# Altium schematic sheet MicroC.SchDoc
size A3; SheetNumber: 2; SheetTotal: 2; SPICEModelCacheYAVJPGAA: <root> / <DocumentId>YAVJPGAA</DocumentId> / <CacheFrame Number="0"> / <Model Name="cap" Kind="MDL"> / <Text>*Default semiconductor capacitor / .MODEL CAP C()</Text> / </Model> / </CacheFrame> / </root>
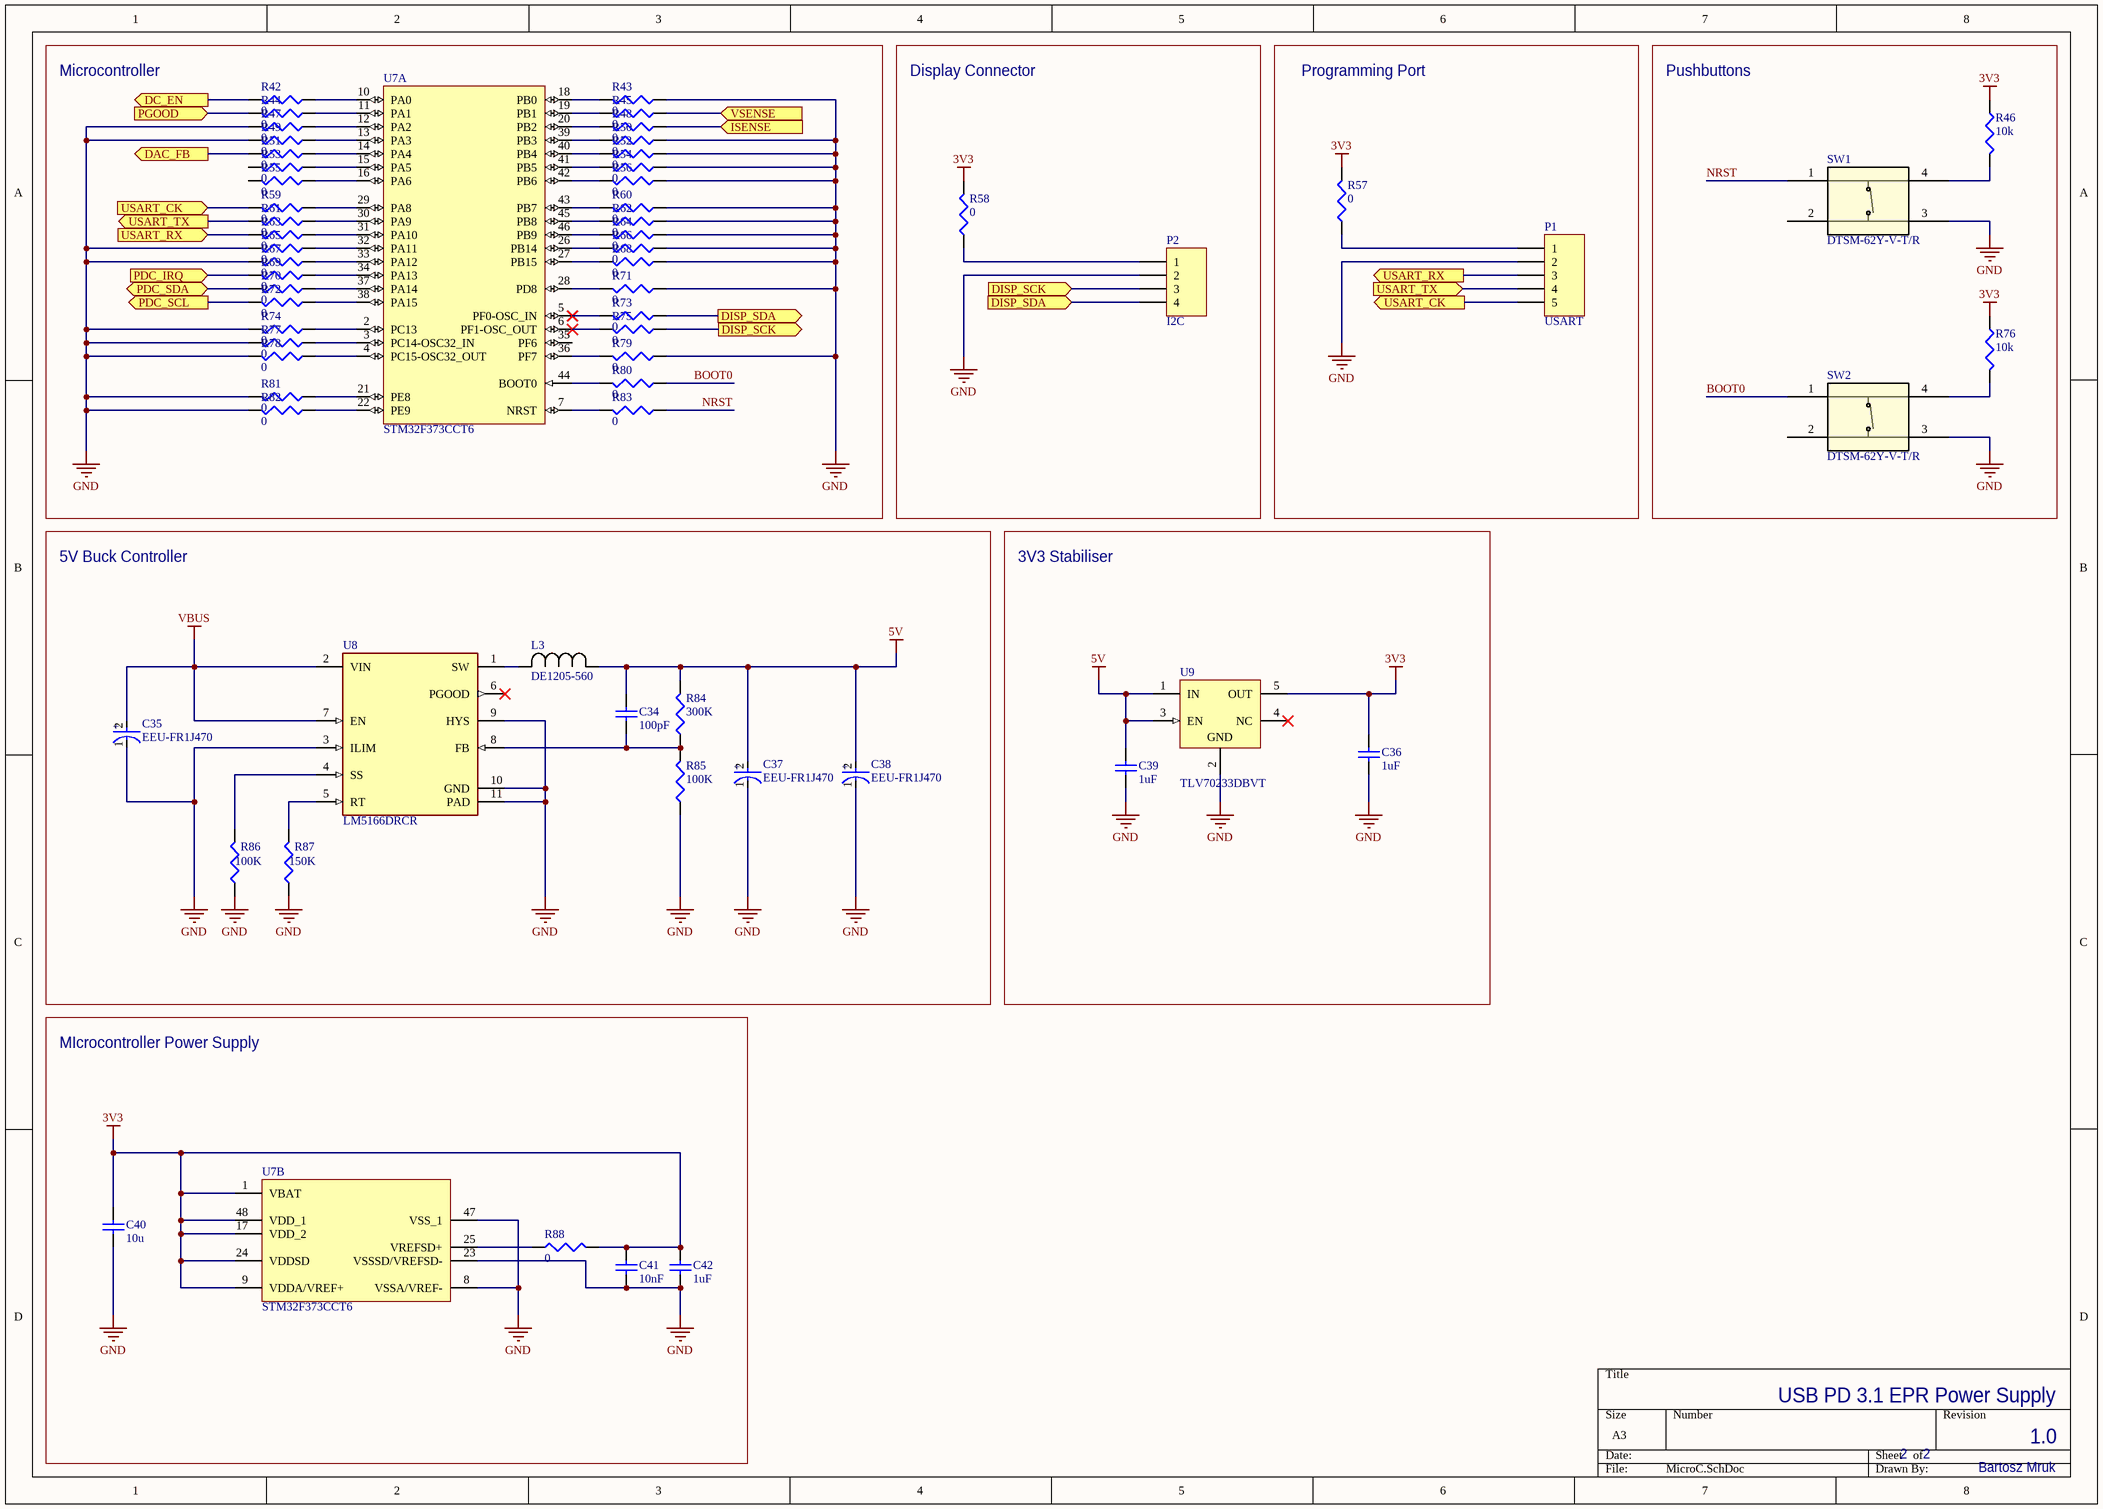
[diagram p0: MicroC.SchDoc]

## Parts
C34  value 100pF  [C1206]  (hidden comment: Cap Semi)
C35  EEU-FR1J470  [FP-EEU-FR1J470-MFG]
C36  value 1uF  [C1206]  (hidden comment: Cap Semi)
C37  EEU-FR1J470  [FP-EEU-FR1J470-MFG]
C38  EEU-FR1J470  [FP-EEU-FR1J470-MFG]
C39  value 1uF  [C1206]  (hidden comment: Cap Semi)
C40  value 10u  [C1206]  (hidden comment: Cap Semi)
C41  value 10nF  [C1206]  (hidden comment: Cap Semi)
C42  value 1uF  [C1206]  (hidden comment: Cap Semi)
L3  DE1205-560  [IND_DE1205_FRC]
P1  USART  [HDR1X5]
P2  I2C  [HDR1X4]
R42  value 0  [J1-0603]
R43  value 0  [J1-0603]
R44  value 0  [J1-0603]
R45  value 0  [J1-0603]
R46  value 10k  [J1-0603]
R47  value 0  [J1-0603]
R48  value 0  [J1-0603]
R49  value 0  [J1-0603]
R50  value 0  [J1-0603]
R51  value 0  [J1-0603]
R52  value 0  [J1-0603]
R53  value 0  [J1-0603]
R54  value 0  [J1-0603]
R55  value 0  [J1-0603]
R56  value 0  [J1-0603]
R57  value 0  [J1-0603]  (hidden comment: Res3)
R58  value 0  [J1-0603]  (hidden comment: Res3)
R59  value 0  [J1-0603]
R60  value 0  [J1-0603]
R61  value 0  [J1-0603]
R62  value 0  [J1-0603]
R63  value 0  [J1-0603]
R64  value 0  [J1-0603]
R65  value 0  [J1-0603]
R66  value 0  [J1-0603]
R67  value 0  [J1-0603]
R68  value 0  [J1-0603]
R69  value 0  [J1-0603]
R70  value 0  [J1-0603]
R71  value 0  [J1-0603]
R72  value 0  [J1-0603]
R73  value 0  [J1-0603]
R74  value 0  [J1-0603]
R75  value 0  [J1-0603]
R76  value 10k  [J1-0603]
R77  value 0  [J1-0603]
R78  value 0  [J1-0603]
R79  value 0  [J1-0603]
R80  value 0  [J1-0603]
R81  value 0  [J1-0603]
R82  value 0  [J1-0603]
R83  value 0  [J1-0603]
R84  value 300K  [J1-0603]  (hidden comment: Res3)
R85  value 100K  [J1-0603]  (hidden comment: Res3)
R86  value 100K  [J1-0603]  (hidden comment: Res3)
R87  value 150K  [J1-0603]  (hidden comment: Res3)
R88  value 0  [J1-0603]  (hidden comment: Res3)
SW1  DTSM-62Y-V-T/R  [DTSM-62_DIP]
SW2  DTSM-62Y-V-T/R  [DTSM-62_DIP]
U7  STM32F373CCT6  [STM-LQFP48_M]  (parts A,B of 2)
U8  LM5166DRCR  [FP-DRC0010J-MFG]
U9  TLV70233DBVT  [DBV0005A_M]

## Blocks framed on the sheet
Microcontroller: R42-R45 R47-R56 R59-R75 R77-R83 U7
Display Connector: P2 R58
Programming Port: P1 R57
Pushbuttons: R46 R76 SW1 SW2
5V Buck Controller: C34 C35 C37 C38 L3 R84-R87 U8
3V3 Stabiliser: C36 C39 U9
MIcrocontroller Power Supply: C40-C42 R88 U7

## Ports
DAC_FB (out, see Main[4D]), DC_EN (out, see Main[2D]), DISP_SCK (in, see MicroC[3A]), DISP_SCK (out, see MicroC[4A]), DISP_SDA (in, see MicroC[3A]), DISP_SDA (out, see MicroC[4A]), ISENSE (in, see Main[5B]), PDC_IRQ (in, see Main[6A]), PDC_SCL (out, see Main[6A]), PDC_SDA (bidir, see Main[6A]), PGOOD (in, see Main[2D]), USART_CK (in, see MicroC[6A]), USART_CK (out, see MicroC[1A]), USART_RX (in, see MicroC[6A]), USART_RX (out, see MicroC[1A]), USART_TX (in, see MicroC[1A]), USART_TX (out, see MicroC[6A]), VSENSE (in, see Main[3B])

## Nets
3V3: C36.2 C40.2 C41.2 C42.2 R46.1 R57.2 R58.2 R76.1 R88.2 U7.1(VBAT) U7.9(VDDA/VREF+) U7.17(VDD_2) U7.24(VDDSD) U7.48(VDD_1) U9.5(OUT)
5V: C34.2 C37.2(A) C38.2(A) C39.2 L3.1 R84.2 U9.1(IN) U9.3(EN)
GND: C35.1(C) C36.1 C37.1(C) C38.1(C) C39.1 C40.1 C41.1 C42.1 P1.2 P2.2 R43.1 R47.2 R49.2 R50.1 R52.1 R54.1 R56.1 R60.1 R62.1 R64.1 R65.2 R66.1 R67.2 R68.1 R71.1 R74.2 R77.2 R78.2 R79.1 R81.2 R82.2 R85.1 R86.1 R87.1 SW1.3 SW2.3 U7.8(VSSA/VREF-) U7.23(VSSSD/VREFSD-) U7.47(VSS_1) U8.3(ILIM) U8.9(HYS) U8.10(GND) U8.11(PAD) U9.2(GND)
VBUS: C35.2(A) U8.2(VIN) U8.7(EN)
BOOT0: R80.1 SW2.1
DAC_FB: R51.2 ; port DAC_FB
DC_EN: R42.2 ; port DC_EN
DISP_SCK: P2.3 R75.1 ; port DISP_SCK
DISP_SDA: P2.4 R73.1 ; port DISP_SDA
ISENSE: R48.1 ; port ISENSE
NRST: R83.1 SW1.1
PDC_IRQ: R69.2 ; port PDC_IRQ
PDC_SCL: R72.2 ; port PDC_SCL
PDC_SDA: R70.2 ; port PDC_SDA
PGOOD: R44.2 ; port PGOOD
USART_CK: P1.5 R59.2 ; port USART_CK
USART_RX: P1.3 R63.2 ; port USART_RX
USART_TX: P1.4 R61.2 ; port USART_TX
VSENSE: R45.1 ; port VSENSE
NetC34_1: C34.1 R84.1 R85.2 U8.8(FB)
NetL3_2: L3.2 U8.1(SW)
NetP1_1: P1.1 R57.1
NetP2_1: P2.1 R58.1
NetR42_1: R42.1 U7.10(PA0)
NetR43_2: R43.2 U7.18(PB0)
NetR44_1: R44.1 U7.11(PA1)
NetR45_2: R45.2 U7.19(PB1)
NetR46_2: R46.2 SW1.4
NetR47_1: R47.1 U7.12(PA2)
NetR48_2: R48.2 U7.20(PB2)
NetR49_1: R49.1 U7.13(PA3)
NetR50_2: R50.2 U7.39(PB3)
NetR51_1: R51.1 U7.14(PA4)
NetR52_2: R52.2 U7.40(PB4)
NetR53_1: R53.1 U7.15(PA5)
NetR54_2: R54.2 U7.41(PB5)
NetR55_1: R55.1 U7.16(PA6)
NetR56_2: R56.2 U7.42(PB6)
NetR59_1: R59.1 U7.29(PA8)
NetR60_2: R60.2 U7.43(PB7)
NetR61_1: R61.1 U7.30(PA9)
NetR62_2: R62.2 U7.45(PB8)
NetR63_1: R63.1 U7.31(PA10)
NetR64_2: R64.2 U7.46(PB9)
NetR65_1: R65.1 U7.32(PA11)
NetR66_2: R66.2 U7.26(PB14)
NetR67_1: R67.1 U7.33(PA12)
NetR68_2: R68.2 U7.27(PB15)
NetR69_1: R69.1 U7.34(PA13)
NetR70_1: R70.1 U7.37(PA14)
NetR71_2: R71.2 U7.28(PD8)
NetR72_1: R72.1 U7.38(PA15)
NetR73_2: R73.2 U7.5(PF0-OSC_IN)
NetR74_1: R74.1 U7.2(PC13)
NetR75_2: R75.2 U7.6(PF1-OSC_OUT)
NetR76_2: R76.2 SW2.4
NetR77_1: R77.1 U7.3(PC14-OSC32_IN)
NetR78_1: R78.1 U7.4(PC15-OSC32_OUT)
NetR79_2: R79.2 U7.36(PF7)
NetR80_2: R80.2 U7.44(BOOT0)
NetR81_1: R81.1 U7.21(PE8)
NetR82_1: R82.1 U7.22(PE9)
NetR83_2: R83.2 U7.7(NRST)
NetR86_2: R86.2 U8.4(SS)
NetR87_2: R87.2 U8.5(RT)
NetR88_1: R88.1 U7.25(VREFSD+)

Not connected (* = marked no-connect by the designer): R53 2; R55 2; SW1 2; SW2 2; U7 35(PF6); U8 6(PGOOD)*; U9 4(NC)*

## Notes on the sheet
- 2
- 1.0
- USB PD 3.1 EPR Power Supply
- Bartosz Mruk
- (in symbol CMP-05427-000066-1) +

## Library data of the parts
C34 C36 C39-C42 = Cap Semi: Capacitor (Semiconductor SIM Model); Published: 8-Jun-2000; LatestRevisionDate: 29-May-2009; LatestRevisionNote: IPC-7351 Footprint Added.; PackageReference: C1206; Publisher: Altium Limited; PackageDescription: Chip Capacitor
C35 C37 C38 = CMP-05427-000066-1: CAP ALUM 47UF 20% 63V RADIAL; ESR (Equivalent Series Resistance): 210mR; Lead Diameter: 0.5mm; Life (Hours): 5000Hour; Ripple Current (AC): 284mA; Height - Seated (Max): 0.5inch; Radiation Hardening: No; Termination: Radial; Contact Plating: Tin; Length: 11.2mm; Tolerance: 20%; Voltage: 63V; Max Operating Temperature: 105°C; Construction: Cylindrical; Lead Free: Lead Free; Series: FR; Mount: Through Hole; Lead Pitch: 2.5mm; Capacitance: 47uF; Case/Package: Radial; Voltage Rating (DC): 63V; Diameter: 6.3mm; Impedance: 210mR; RoHS Compliant: Yes; Height: 11.2mm; REACH SVHC: No SVHC; Package Quantity: 200; Ripple Current: 284mA; Voltage Rating: 63V; Packaging: Bulk; Min Operating Temperature: -40°C
L3 = DE1205-560: Description; Manufacturer_Name: FerroCore; Copyright: Copyright (C) 2025 Ultra Librarian. All rights reserved.; Manufacturer_Part_Number: DE1205-560
P1 = Header 5: Header, 5-Pin; LatestRevisionDate: 17-Jul-2002; LatestRevisionNote: Re-released for DXP Platform.; Publisher: Altium Limited
P2 = Header 4: Header, 4-Pin; LatestRevisionDate: 17-Jul-2002; LatestRevisionNote: Re-released for DXP Platform.; Publisher: Altium Limited
R42-R88 = Res3: Resistor; Published: 8-Jun-2000; LatestRevisionDate: 29-May-2009; LatestRevisionNote: IPC-7351 Footprint Added.; PackageReference: J1-0603; Publisher: Altium Limited; PackageDescription: Chip Resistor
SW1 SW2 = DTSM-62Y-V-TR: Description; Manufacturer_Name: Diptronics; Copyright: Copyright (C) 2025 Ultra Librarian. All rights reserved.; Manufacturer_Part_Number: DTSM-62Y-V-T/R; RefDes: RefDes; Type: Type
U7 = CMP-0572-00021-2: ARM Cortex-M4 32-bit MCU, 256 KB Flash, 32 KB Internal RAM, 36 I/Os, 48-pin LQFP, -40 to 85 degC, Tray; FLASH Size (Prog) (kB): 256; Internal RAM Size (kB): 32; Operating Frequency(F) (Processor speed) (MHz): 72; I/Os (High Current): 36; Supply Voltage(Vcc) min (V): 2; Mounting Technology: Surface Mount; ComponentLink2Description: Datasheet; PackageReference: LQFP48; Packing: Tray; PackageVersion: Rev. 6, 06/2013; ComponentLink1Description: Manufacturer URL; ComponentLink3Description: Package Specification; ComponentLink2URL: http://www.st.com/st-web-ui/static/active/en/resource/technical/document/datasheet/DM00046749.pdf; PartNumber: STM32F373CCT6; Core: ARM Cortex-M4; ComponentLink1URL: http://www.st.com/web/en/home.html; ComponentLink3URL: http://www.st.com/st-web-ui/static/active/en/resource/technical/document/datasheet/DM00058181.pdf; DatasheetVersion: Rev. 3; PackageDescription: 48-Pin Low Profile Quad Flat Package, 7 x 7 mm Body, 0.5 mm Pitch
U8 = CMP-04918-000087-1: IC REG BUCK ADJ 500MA 10VSON; Manufacturer: Texas Instruments; Output Voltage: 1.23-65V; Switching Frequency: 50-600kHz; Description: Buck Switching Regulator IC Positive Adjustable 1.23V 1 Output 500mA 10-VFDFN Exposed Pad; Nominal Supply Current: 205-320uA; Max Supply Voltage: 65V; Min Supply Voltage: 3V; Output Type: AdjustableProgrammable; Max Duty Cycle: 100%; Max Junction Temp: +150°C; Standoff Height: 0mm; Number Of Outputs: 1; Temperature Range Low: -40°C; Octopart: https://octopart.com/lm5166drcr-texas+instruments-77040222; Height: 1mm; Temperature: -40°C to +150°C; ComponentLink2Description: Datasheet; Device Class L1: Integrated Circuits (ICs); ComponentLink2URL: http://www.ti.com/lit/ds/symlink/lm5166.pdf; Device Class L3: Voltage Regulators - Switching; Lead Free: Yes; Manufacturer Part Number: LM5166DRCR; RoHS: TRUE; Switching Topology: Buck; Package: DRC0010J; Digikey Description: IC REG BUCK ADJ 500MA 10VSON; Temperature Range High: +150°C; Output Current: 500mA; Category: IC; Automotive: No; Device Class L2: Power Management ICs
U9 = CMP-0394-00524-3: None; Max Output Voltage: 3.3V; Min Input Voltage: 2V; Quiescent Current: 30uA; Accuracy: 2%; Number of Outputs: 1; Power Dissipation: 500mW; Dropout Voltage: 220mV; Output Voltage Accuracy: 0.5%; Max Output Current: 300mA; Polarity: Positive; Power Supply Rejection Ratio (PSRR): 68dB; Output Type: Fixed; Max Input Voltage: 5.5V; Min Current Limit: 320mA; REACH SVHC: No SVHC; RoHS Compliant: Yes; Length: 3.05mm; Radiation Hardening: No; Lead Free: Lead Free; Height: 1.45mm; Output Voltage: 3.3V; Min Operating Temperature: -40°C; Package Quantity: 1; Width: 1.75mm; Number of Regulators: 1; Case/Package: SOT-23; Number of Pins: 5; Output Current: 300mA; Packaging: Tape and Reel; Min Output Voltage: 3.3V; Max Operating Temperature: 125°C; Series: -; Nominal Output Voltage: 3.3V; Max Power Dissipation: 500mW